# Altium schematic sheet Sheet1.SchDoc
size 420 x 297 mm; PageSetup: Record=PageOptions|CenterHorizontal=True|CenterVertical=True|PrintScale=0.94|XCorrection=1.00|YCorrection=1.00|PrintKind=1|BorderSize=5000000|LeftOffset=0|BottomOffset=0|Orientation=1|PaperLength=1000|PaperWidth=1000|Scale=100|PaperSource=7|PrintQuality=-4|MediaType=1|DitherType=10|PaperKind=A4|PrintScaleMode=1; Address1: Address1; Address2: Address2; Address3: Address3; Address4: Address4; DocumentNumber: 1; SheetNumber: 1; SheetTotal: 4
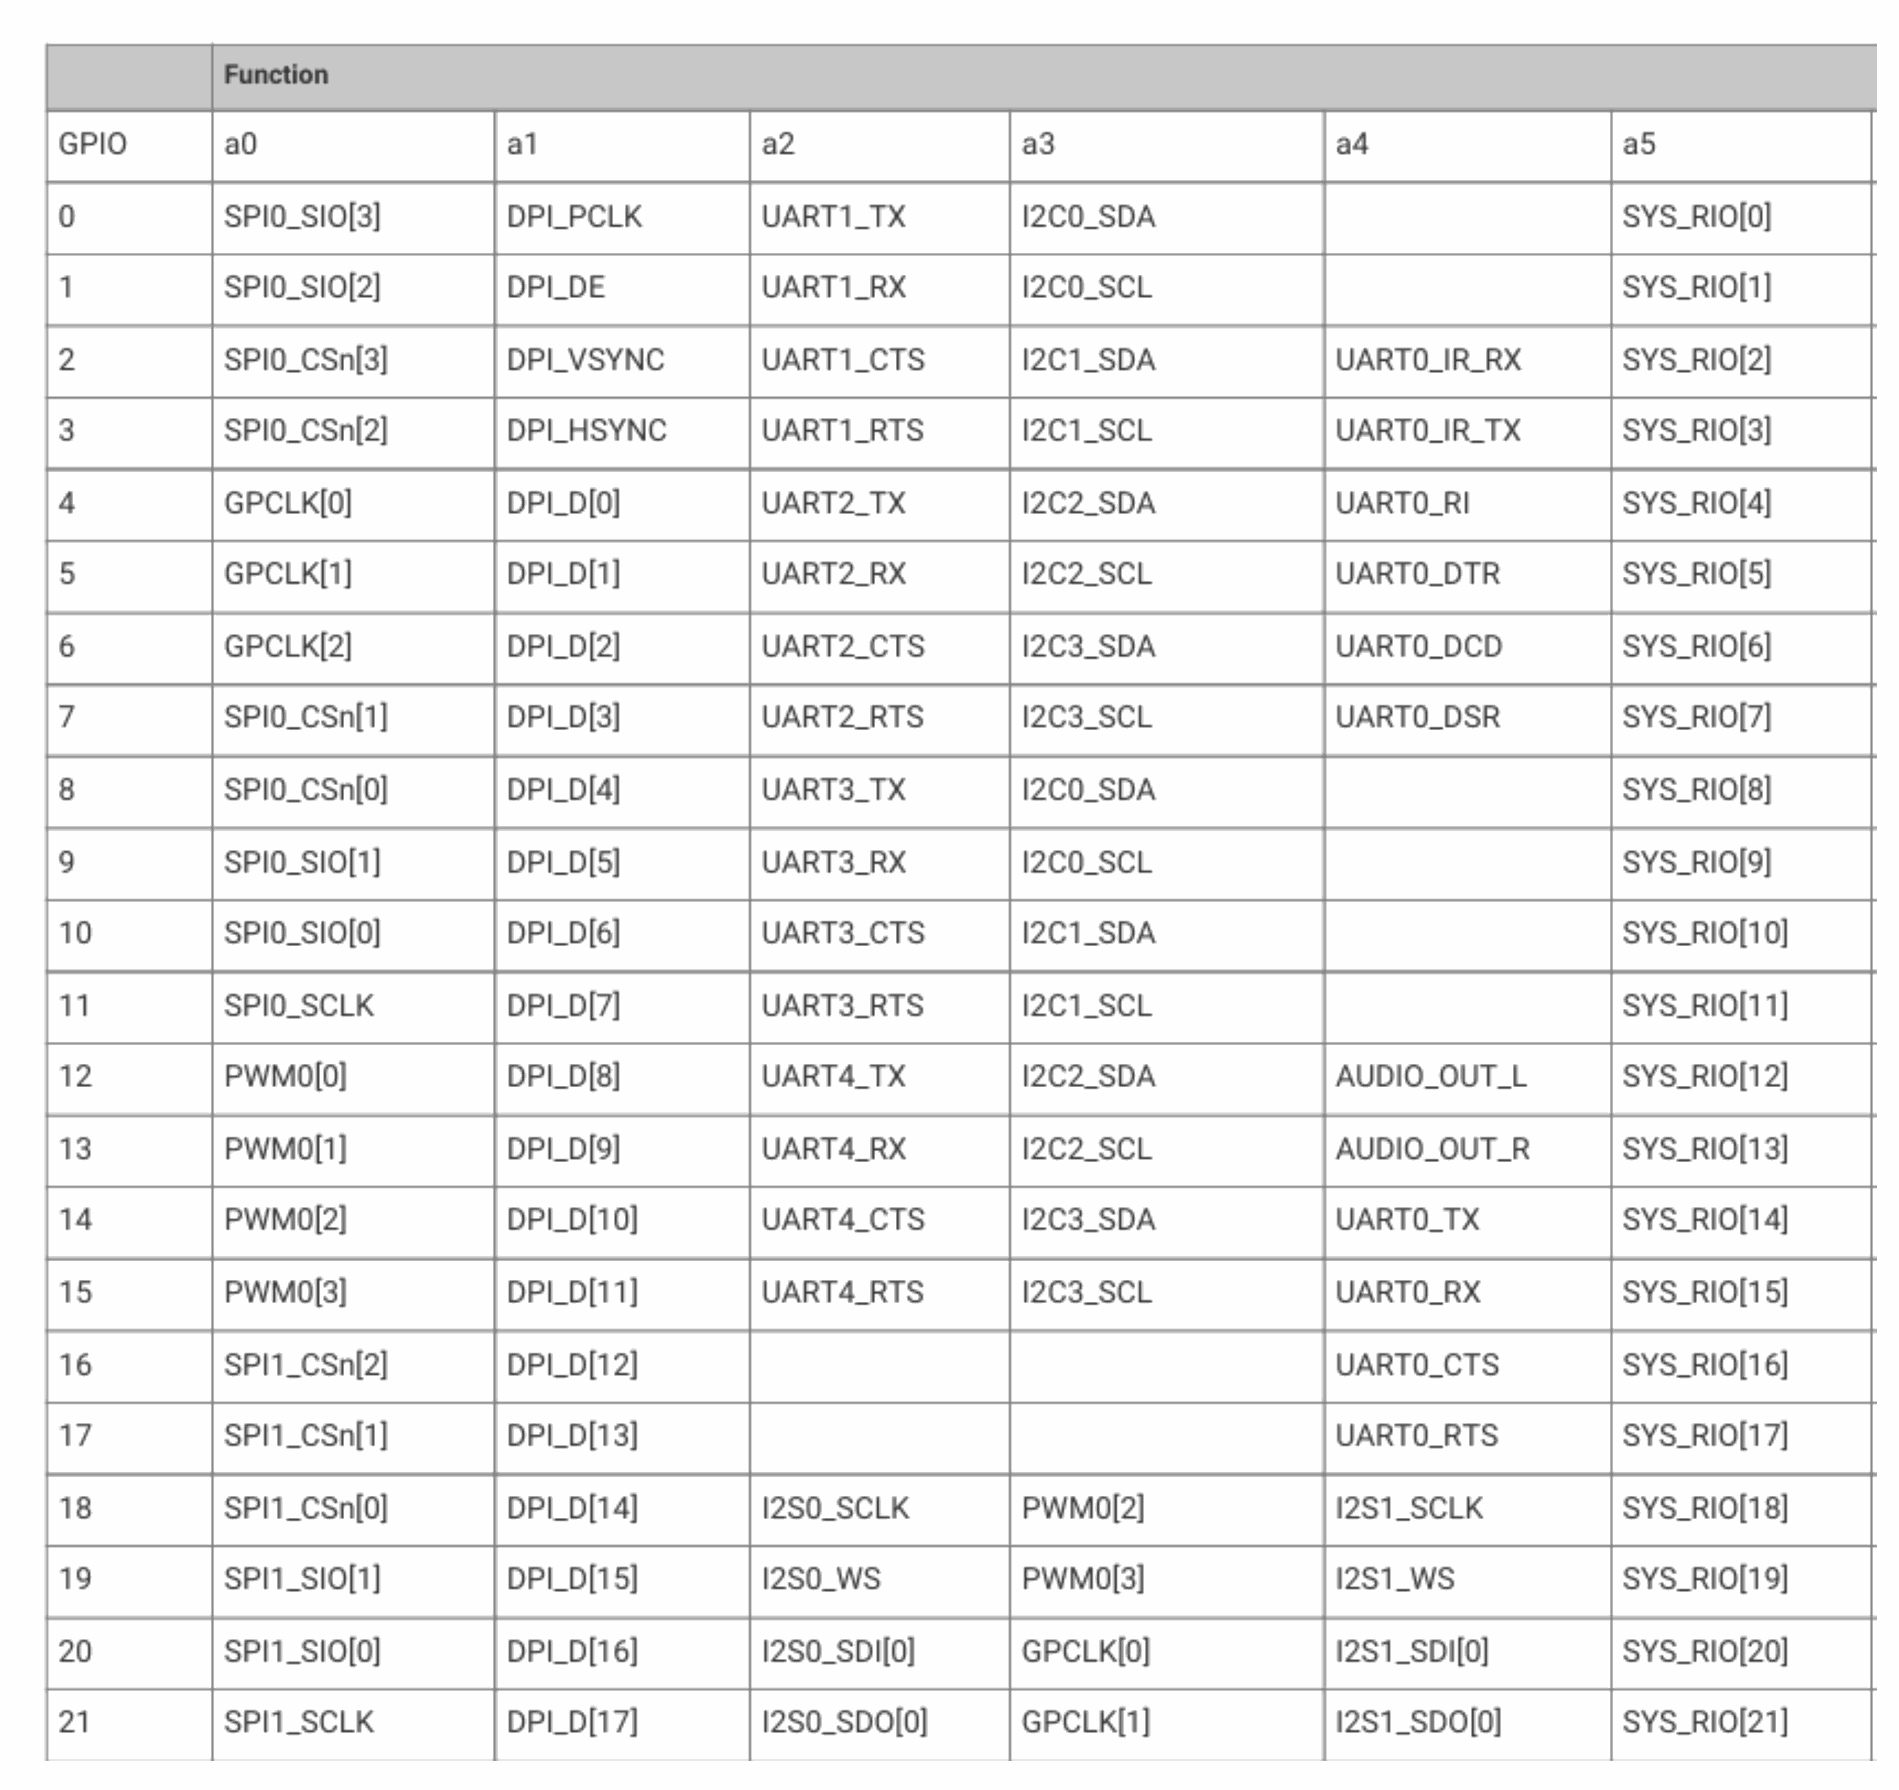
[diagram p0: Sheet1.SchDoc, left]
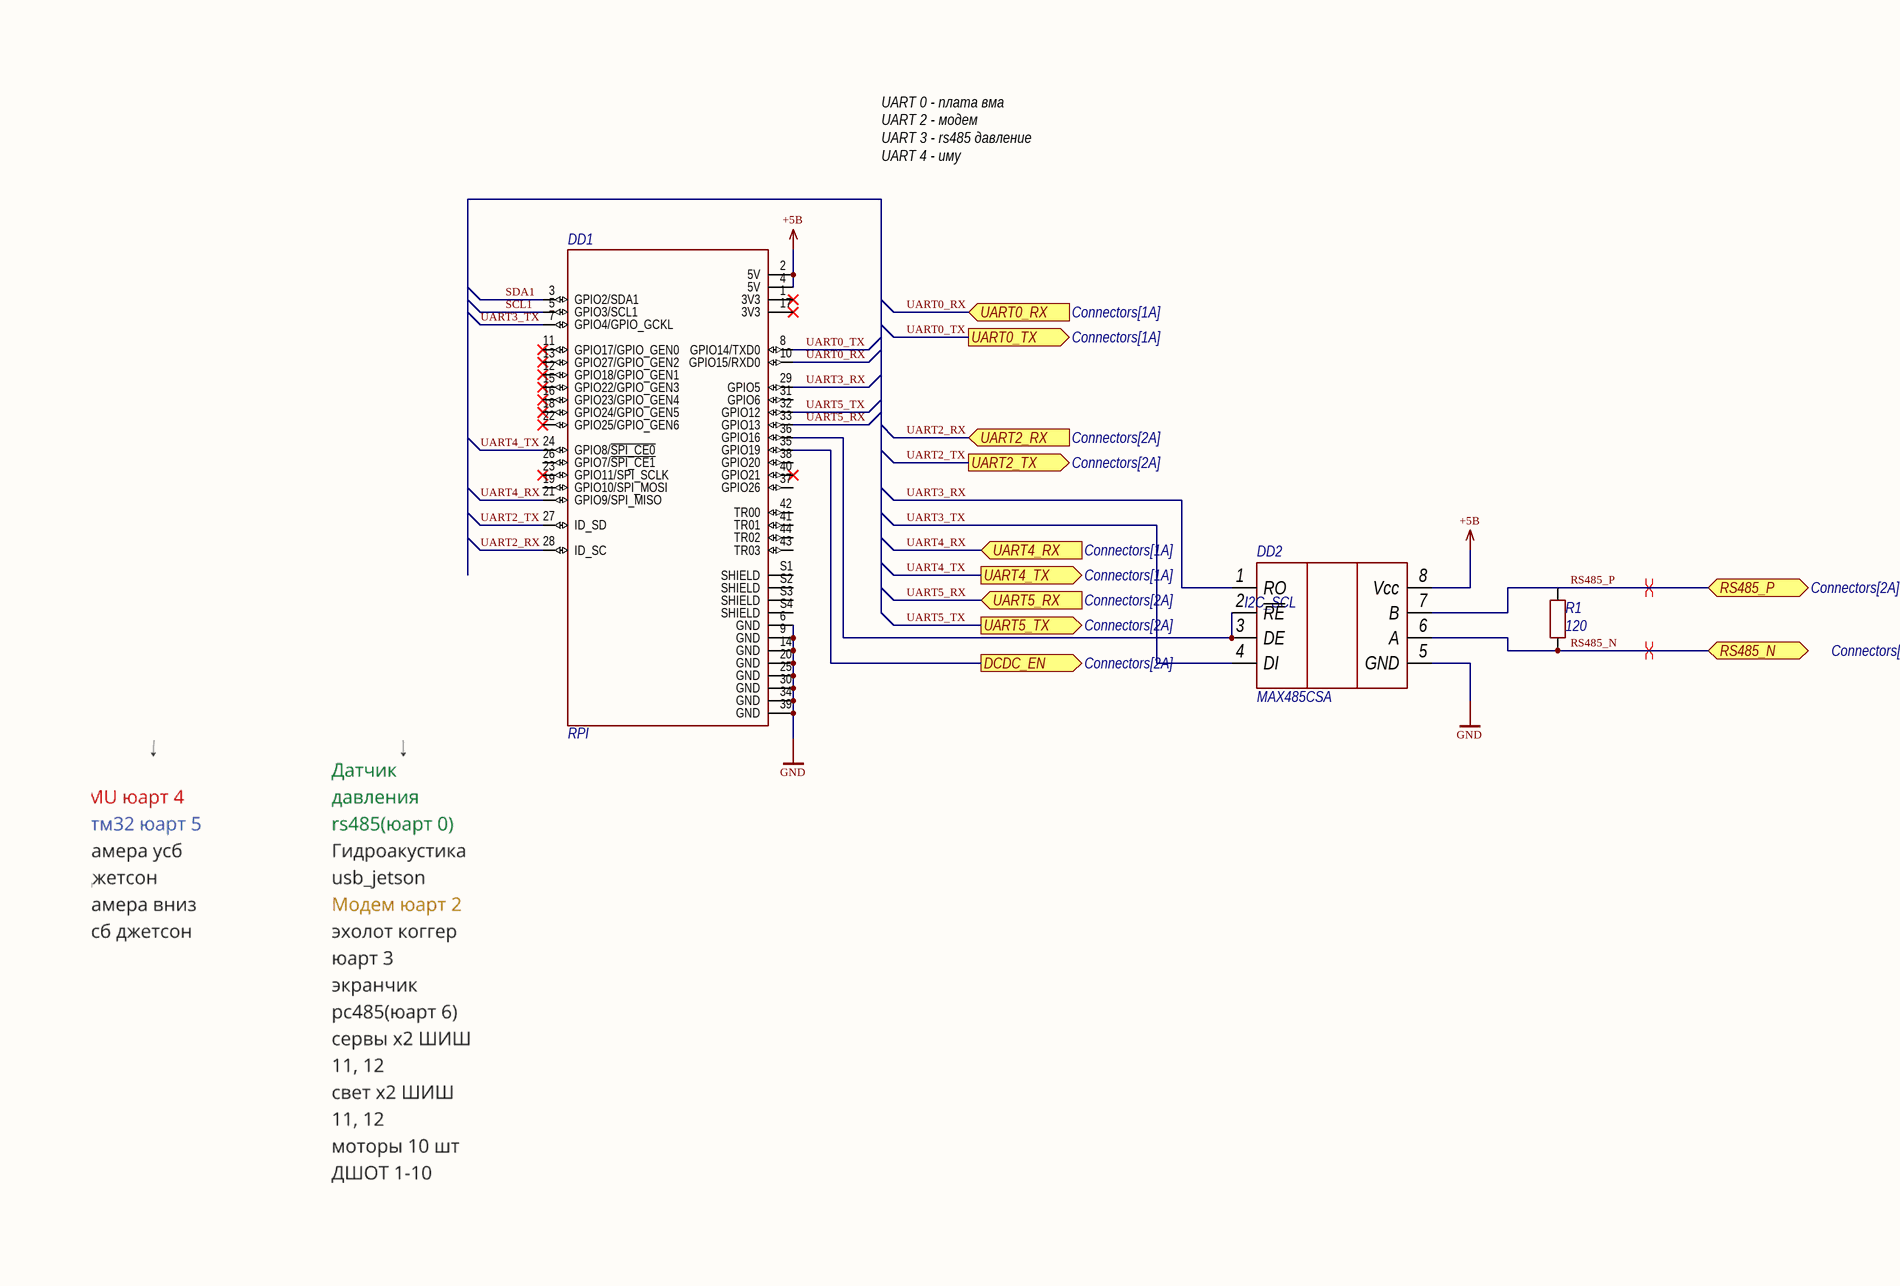
[diagram p1: Sheet1.SchDoc, right]

## Parts
DD1  RPI  [RPI]
DD2  MAX485CSA  [SOIC-8]
R1  value 120  [0603R]  (hidden comment: Resistor)

## Ports
DCDC_EN (out, see Connectors[2A]), RS485_N (bidir, see Connectors[2A]), RS485_P (bidir, see Connectors[2A]), UART0_RX (in, see Connectors[1A]), UART0_TX (out, see Connectors[1A]), UART2_RX (in, see Connectors[2A]), UART2_TX (out, see Connectors[2A]), UART4_RX (in, see Connectors[1A]), UART4_TX (out, see Connectors[1A]), UART5_RX (in, see Connectors[2A]), UART5_TX (out, see Connectors[2A])

## Nets
+5В: DD1.2(5V) DD1.4(5V) DD2.8(Vcc)
GND: DD1.6(GND) DD1.9(GND) DD1.14(GND) DD1.20(GND) DD1.25(GND) DD1.30(GND) DD1.34(GND) DD1.39(GND) DD2.5(GND)
DCDC_EN: DD1.35(GPIO19) ; port DCDC_EN
RS485_N: DD2.6(A) R1.1 ; port RS485_N
RS485_P: DD2.7(B) R1.2 ; port RS485_P
SCL1: DD1.5(GPIO3/SCL1)
SDA1: DD1.3(GPIO2/SDA1)
UART0_RX: DD1.10(GPIO15/RXD0) ; port UART0_RX
UART0_TX: DD1.8(GPIO14/TXD0) ; port UART0_TX
UART2_RX: DD1.28(ID_SC) ; port UART2_RX
UART2_TX: DD1.27(ID_SD) ; port UART2_TX
UART3_RX: DD1.29(GPIO5) DD2.1(RO)
UART3_TX: DD1.7(GPIO4/GPIO_GCKL) DD2.4(DI)
UART4_RX: DD1.21(GPIO9/SPI_MISO) ; port UART4_RX
UART4_TX: DD1.24(GPIO8/~{SPI_CE0}) ; port UART4_TX
UART5_RX: DD1.33(GPIO13) ; port UART5_RX
UART5_TX: DD1.32(GPIO12) ; port UART5_TX
NetDD1_36: DD1.36(GPIO16) DD2.2(~{RE}) DD2.3(DE)

Not connected (* = marked no-connect by the designer): DD1 1(3V3)* 11(GPIO17/GPIO_GEN0)* 12(GPIO18/GPIO_GEN1)* 13(GPIO27/GPIO_GEN2)* 15(GPIO22/GPIO_GEN3)* 16(GPIO23/GPIO_GEN4)* 17(3V3)* 18(GPIO24/GPIO_GEN5)* 19(GPIO10/SPI_MOSI) 22(GPIO25/GPIO_GEN6)* 23(GPIO11/SPI_SCLK)* 26(GPIO7/~{SPI_CE1}) 31(GPIO6) 37(GPIO26) 38(GPIO20) 40(GPIO21)* 41(TR01) 42(TR00) 43(TR03) 44(TR02) S1(SHIELD) S2(SHIELD) S3(SHIELD) S4(SHIELD)

## Layout directives
differential pair: RS485_N, RS485_P

## Notes on the sheet
- UART 0 - плата вма
  UART 2 - модем
  UART 3 - rs485 давление
  UART 4 - иму
- (near DD2) I2C_SCL
- Перв. примен.
- Справ. №
- Подп. и дата
- Инв. № дубл.
- Взам. инв. №
- Разраб.
- Изм.
- Лист
- № докум.
- Подп.
- Дата
- Лит.
- Масса
- Масштаб
- Пров.
- Т.контр.
- Схема электрическая принципиальная
- Листов
- Инв. № подл.
- Утв.
- Н.контр.
- Копировал
- Формат А3

## Library data of the parts
DD1 = RPI: Одноплатный компьютер Raspberry PI 4B; Part Number: RPI
DD2 = MAX485CSA: RS-485 приёмопередатчик; Part Number: MAX485CSA
R1 = Resistor_120_1_0603: Резистор номиналом 120 Ом и точностью 1%; Power: *; Part Number: Resistor_120_1_0603; Tolerance: 1%